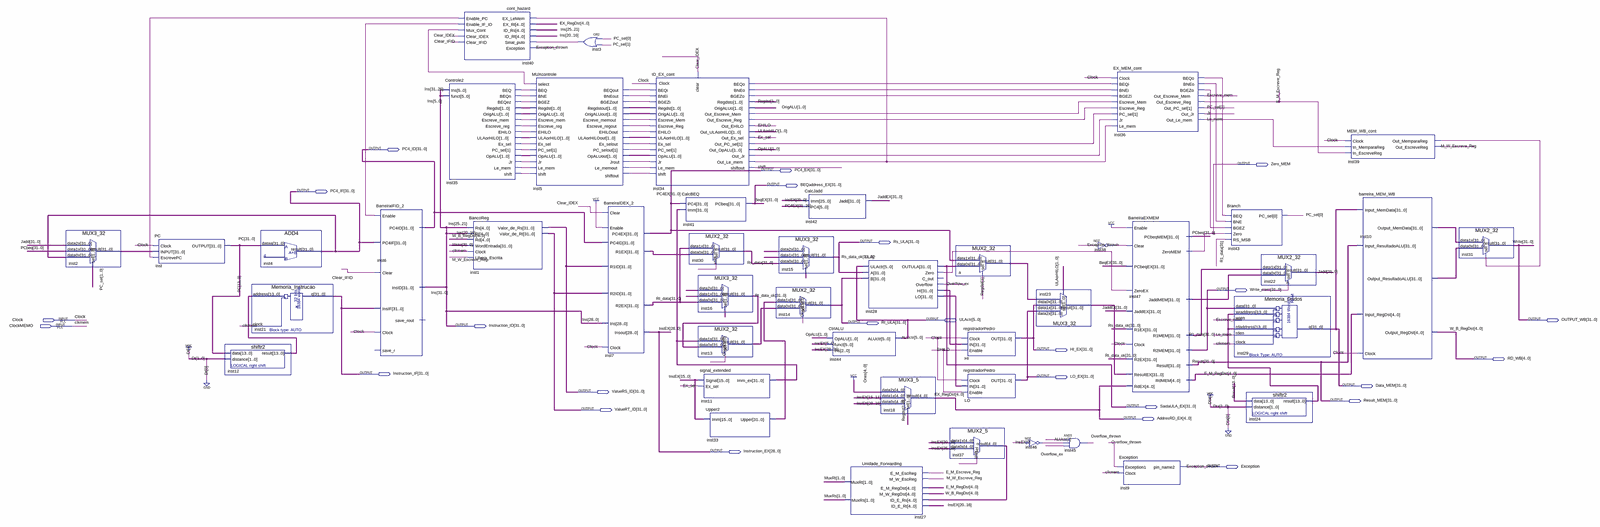
[diagram p0: schematic sheet, whole]
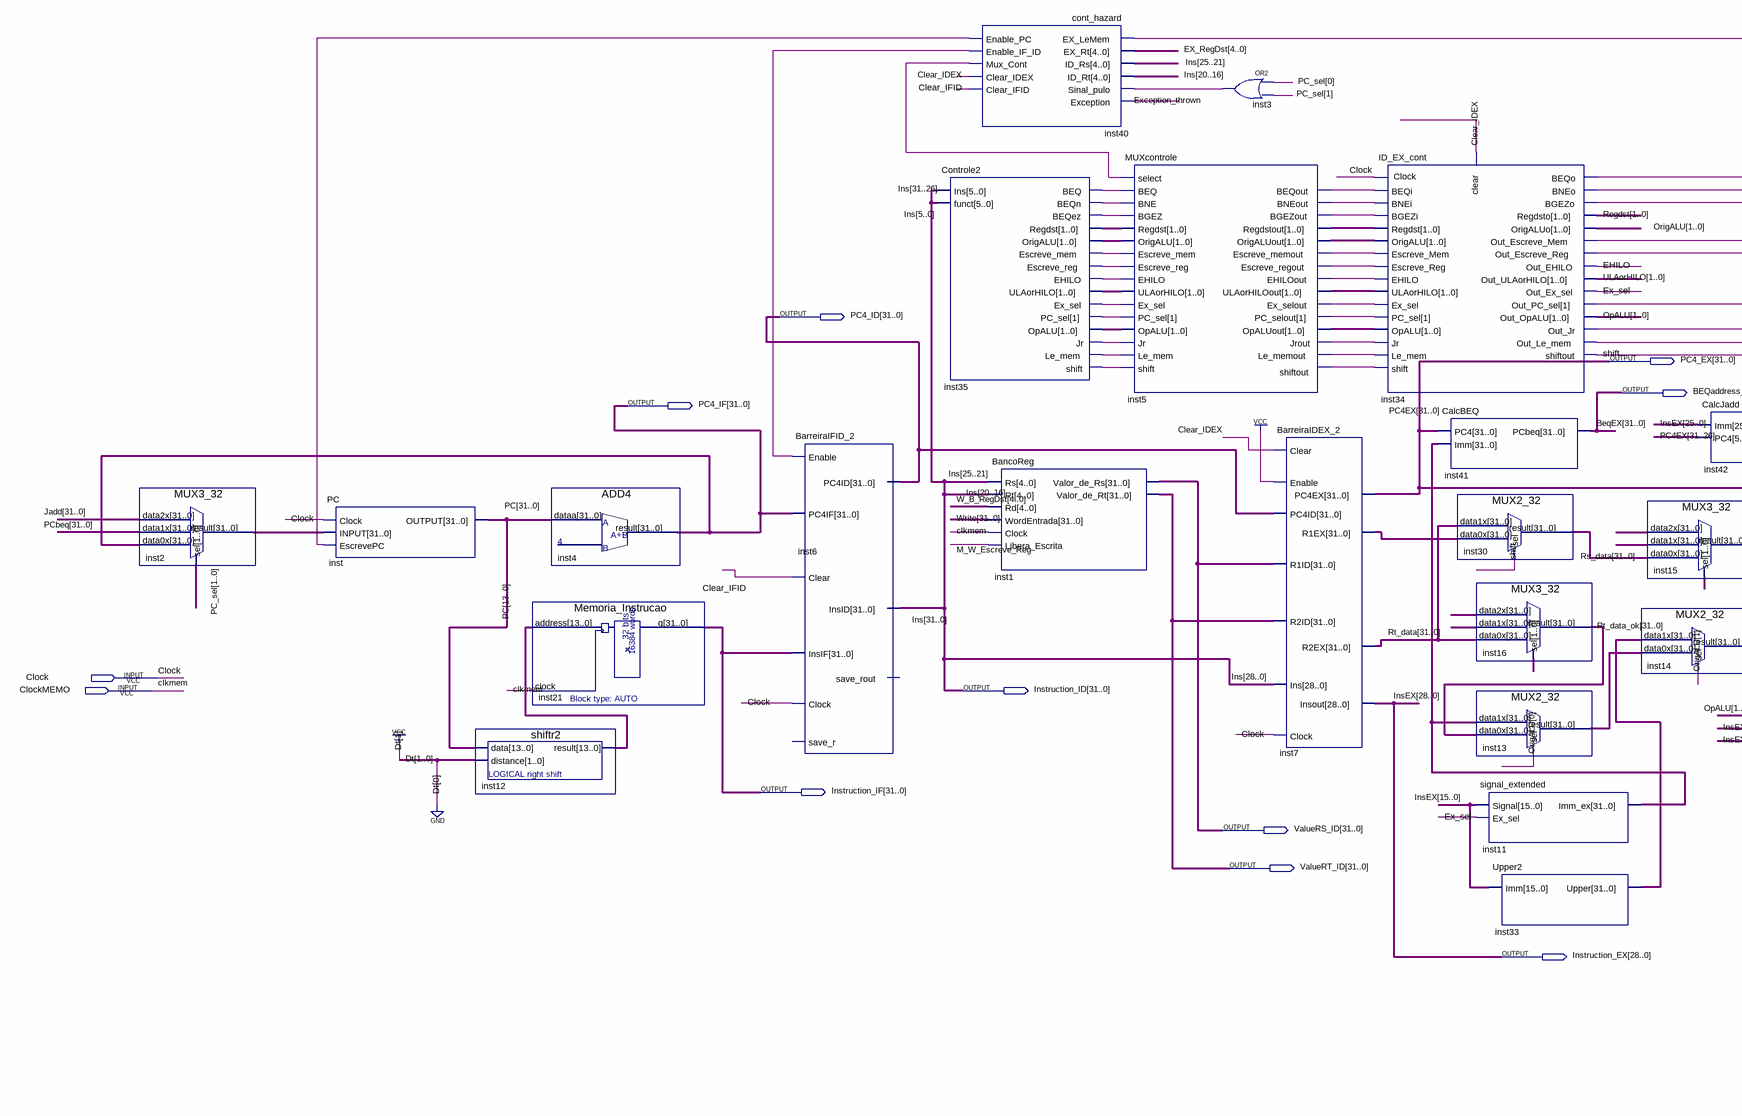
[diagram p1: schematic sheet, left part]
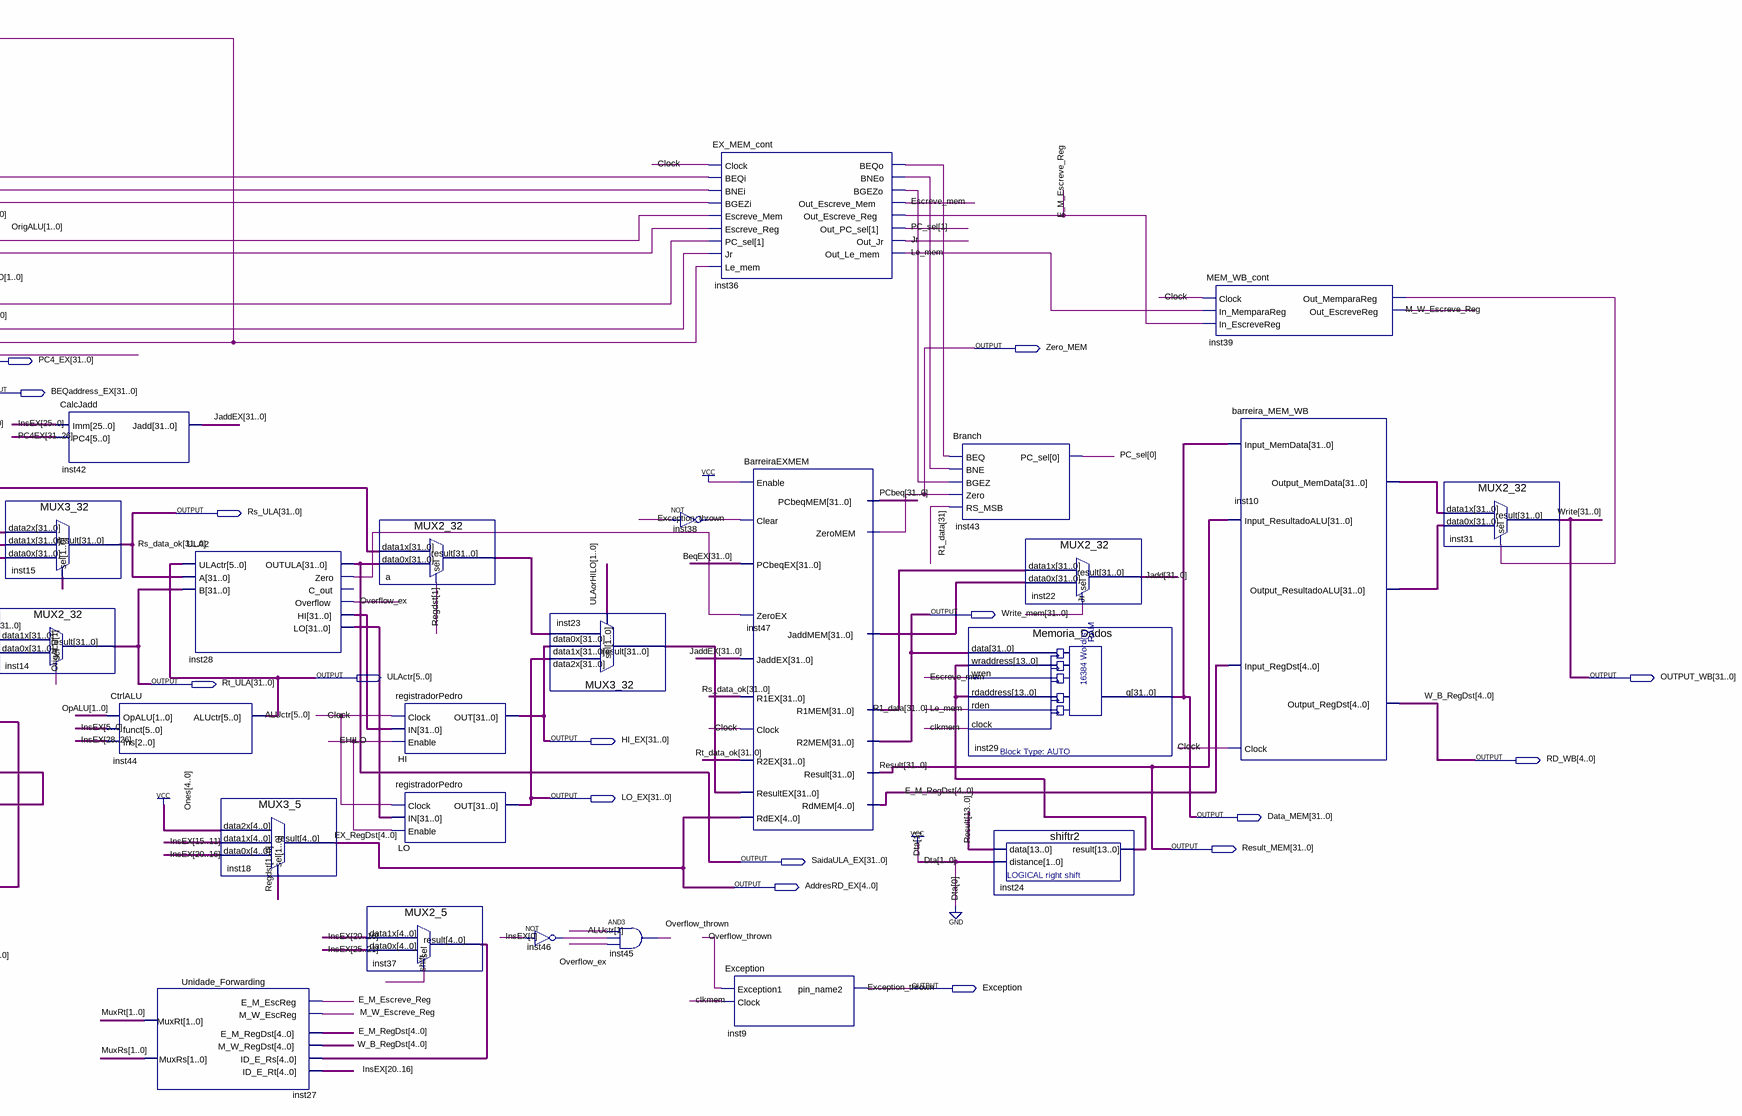
[diagram p2: schematic sheet, right part]
// Quartus schematic PIPELINE_FULL.bdf as structural Verilog: 44 symbols, 25 pins
module PIPELINE_FULL (
  input  Clock,
  input  ClockMEMO,
  output [31:0] PC4_ID,
  output Zero_MEM,
  output [31:0] PC4_EX,
  output [31:0] BEQaddress_EX,
  output [31:0] PC4_IF,
  output [31:0] Rs_ULA,
  output [31:0] Write_mem,
  output [5:0] ULActr,
  output [31:0] OUTPUT_WB,
  output [31:0] Rt_ULA,
  output [31:0] Instruction_ID,
  output [31:0] HI_EX,
  output [4:0] RD_WB,
  output [31:0] Instruction_IF,
  output [31:0] LO_EX,
  output [31:0] Data_MEM,
  output [31:0] ValueRS_ID,
  output [31:0] Result_MEM,
  output [31:0] SaidaULA_EX,
  output [31:0] ValueRT_ID,
  output [4:0] AddresRD_EX,
  output [28:0] Instruction_EX,
  output Exception
);

  wire Clear_IDEX, Clear_IFID, E_M_Escreve_Reg, EHILO, Escreve_mem, Ex_sel, inst3_out, inst5_beqout,
       inst5_bgezout, inst5_bneout, inst5_ehiloout, inst5_escreve_memout, inst5_escreve_regout,
       inst5_ex_selout, inst5_jrout, inst5_le_memout, inst5_pc_selout, inst5_shiftout, inst28_zero,
       inst34_beqo, inst34_bgezo, inst34_bneo, inst34_out_escreve_mem, inst34_out_escreve_reg, inst34_out_jr,
       inst34_out_le_mem, inst34_out_pc_sel, inst35_beq, inst35_beqez, inst35_beqn, inst35_ehilo,
       inst35_escreve_mem, inst35_escreve_reg, inst35_ex_sel, inst35_jr, inst35_le_mem, inst35_pc_sel,
       inst35_shift, inst36_beqo, inst36_bgezo, inst36_bneo, inst38_out, inst39_out_memparareg,
       inst40_enable_if_id, inst40_enable_pc, inst40_mux_cont, inst46_out, Jr, Le_mem, M_W_Escreve_Reg,
       Overflow_ex, Overflow_thrown, shift;
  wire [1:0] inst5_opaluout, inst5_origaluout, inst5_regdstout, inst5_ulaorhiloout, inst35_opalu,
       inst35_origalu, inst35_regdst, inst35_ulaorhilo, MuxRs, MuxRt, OpALU, OrigALU, PC_sel, Regdst,
       ULAorHILO;
  wire [4:0] E_M_RegDst, inst37_result;
  wire [13:0] inst12_result, inst24_result;
  wire [31:0] a_result, inst2_result, inst7_r1ex, inst10_output_memdata, inst10_output_resultadoalu,
       inst11_imm_ex, inst13_result, inst23_result, inst28_hi, inst28_lo, inst33_upper, inst47_jaddmem, Jadd,
       JaddEX, PC, PCbeq, R1_data, Rs_data, Rt_data, Rt_data_ok;

  MUX3_32 inst2 (.data2x(Jadd), .data1x(PCbeq), .data0x(PC4_IF), .sel(PC_sel), .result(inst2_result));
  PC inst (.EscrevePC(inst40_enable_pc), .Clock(Clock), .INPUT(inst2_result), .OUTPUT(PC));
  shiftr2 inst12 (.data(PC[13:0]), .distance(2'b10), .result(inst12_result));
  Memoria_Instrucao inst21 (.address(inst12_result), .clock(ClockMEMO), .q(Instruction_IF));
  ADD4 inst4 (.dataa(PC), .result(PC4_IF));
  BarreiraIFID_2 inst6 (
    .Enable(inst40_enable_if_id), .PC4IF(PC4_IF), .Clear(Clear_IFID), .InsIF(Instruction_IF), .Clock(Clock),
    .PC4ID(PC4_ID), .InsID(Instruction_ID));  // open: save_r, save_rout
  Controle2 inst35 (
    .Ins(Instruction_ID[31:26]), .funct(Instruction_ID[5:0]), .BEQ(inst35_beq), .BEQn(inst35_beqn),
    .BEQez(inst35_beqez), .Regdst(inst35_regdst), .OrigALU(inst35_origalu), .Escreve_mem(inst35_escreve_mem),
    .Escreve_reg(inst35_escreve_reg), .EHILO(inst35_ehilo), .ULAorHILO(inst35_ulaorhilo),
    .Ex_sel(inst35_ex_sel), .PC_sel(inst35_pc_sel), .OpALU(inst35_opalu), .Jr(inst35_jr),
    .Le_mem(inst35_le_mem), .shift(inst35_shift));
  cont_hazard inst40 (
    .EX_LeMem(inst34_out_le_mem), .EX_Rt(AddresRD_EX), .ID_Rs(Instruction_ID[25:21]),
    .ID_Rt(Instruction_ID[20:16]), .Sinal_pulo(inst3_out), .Exception(Exception),
    .Enable_PC(inst40_enable_pc), .Enable_IF_ID(inst40_enable_if_id), .Mux_Cont(inst40_mux_cont),
    .Clear_IDEX(Clear_IDEX), .Clear_IFID(Clear_IFID));
  BancoReg inst1 (
    .Rt(Instruction_ID[20:16]), .Rd(RD_WB), .Rs(Instruction_ID[25:21]), .WordEntrada(OUTPUT_WB),
    .Clock(ClockMEMO), .Libera_Escrita(M_W_Escreve_Reg), .Valor_de_Rs(ValueRS_ID), .Valor_de_Rt(ValueRT_ID));
  MUXcontrole inst5 (
    .select(inst40_mux_cont), .BEQ(inst35_beq), .BNE(inst35_beqn), .BGEZ(inst35_beqez),
    .Regdst(inst35_regdst), .OrigALU(inst35_origalu), .Escreve_mem(inst35_escreve_mem),
    .Escreve_reg(inst35_escreve_reg), .EHILO(inst35_ehilo), .ULAorHILO(inst35_ulaorhilo),
    .Ex_sel(inst35_ex_sel), .PC_sel(inst35_pc_sel), .OpALU(inst35_opalu), .Jr(inst35_jr),
    .Le_mem(inst35_le_mem), .shift(inst35_shift), .BEQout(inst5_beqout), .BNEout(inst5_bneout),
    .BGEZout(inst5_bgezout), .Regdstout(inst5_regdstout), .OrigALUout(inst5_origaluout),
    .Escreve_memout(inst5_escreve_memout), .Escreve_regout(inst5_escreve_regout), .EHILOout(inst5_ehiloout),
    .ULAorHILOout(inst5_ulaorhiloout), .Ex_selout(inst5_ex_selout), .PC_selout(inst5_pc_selout),
    .OpALUout(inst5_opaluout), .Jrout(inst5_jrout), .Le_memout(inst5_le_memout), .shiftout(inst5_shiftout));
  or inst3 (inst3_out, PC_sel[0], PC_sel[1]);
  BarreiraIDEX_2 inst7 (
    .Clear(Clear_IDEX), .Enable(1'b1), .PC4ID(PC4_ID), .R1ID(ValueRS_ID), .R2ID(ValueRT_ID),
    .Ins(Instruction_ID[28:0]), .Clock(Clock), .PC4EX(PC4_EX), .R1EX(inst7_r1ex), .R2EX(Rt_data),
    .Insout(Instruction_EX));
  ID_EX_cont inst34 (
    .clear(Clear_IDEX), .Clock(Clock), .BEQi(inst5_beqout), .BNEi(inst5_bneout), .BGEZi(inst5_bgezout),
    .Regdst(inst5_regdstout), .OrigALU(inst5_origaluout), .Escreve_Mem(inst5_escreve_memout),
    .Escreve_Reg(inst5_escreve_regout), .EHILO(inst5_ehiloout), .ULAorHILO(inst5_ulaorhiloout),
    .Ex_sel(inst5_ex_selout), .PC_sel(inst5_pc_selout), .OpALU(inst5_opaluout), .Jr(inst5_jrout),
    .Le_mem(inst5_le_memout), .shift(inst5_shiftout), .BEQo(inst34_beqo), .BNEo(inst34_bneo),
    .BGEZo(inst34_bgezo), .Regdsto(Regdst), .OrigALUo(OrigALU), .Out_Escreve_Mem(inst34_out_escreve_mem),
    .Out_Escreve_Reg(inst34_out_escreve_reg), .Out_EHILO(EHILO), .Out_ULAorHILO(ULAorHILO),
    .Out_Ex_sel(Ex_sel), .Out_PC_sel(inst34_out_pc_sel), .Out_OpALU(OpALU), .Out_Jr(inst34_out_jr),
    .Out_Le_mem(inst34_out_le_mem), .shiftout(shift));
  CalcBEQ inst41 (.PC4(PC4_EX), .Imm(inst11_imm_ex), .PCbeq(BEQaddress_EX));
  MUX2_32 inst30 (.data1x(Rt_data), .data0x(inst7_r1ex), .sel(shift), .result(Rs_data));
  MUX3_32 inst16 (.data2x(Result_MEM), .data1x(OUTPUT_WB), .data0x(Rt_data), .sel(MuxRt), .result(Rt_data_ok));
  MUX2_32 inst13 (.data1x(inst11_imm_ex), .data0x(Rt_data_ok), .sel(OrigALU[0]), .result(inst13_result));
  signal_extended inst11 (.Signal(Instruction_EX[15:0]), .Ex_sel(Ex_sel), .Imm_ex(inst11_imm_ex));
  Upper2 inst33 (.Imm(Instruction_EX[15:0]), .Upper(inst33_upper));
  MUX3_32 inst15 (.data2x(Result_MEM), .data1x(OUTPUT_WB), .data0x(Rs_data), .sel(MuxRs), .result(Rs_ULA));
  MUX2_32 inst14 (.data1x(inst33_upper), .data0x(inst13_result), .sel(OrigALU[1]), .result(Rt_ULA));
  CalcJadd inst42 (.Imm(Instruction_EX[25:0]), .PC4(PC4_EX[31:26]), .Jadd(JaddEX));
  CtrlALU inst44 (.OpALU(OpALU), .funct(Instruction_EX[5:0]), .Ins(Instruction_EX[28:26]), .ALUctr(ULActr));
  Unidade_Forwarding inst27 (
    .E_M_EscReg(E_M_Escreve_Reg), .M_W_EscReg(M_W_Escreve_Reg), .E_M_RegDst(E_M_RegDst), .M_W_RegDst(RD_WB),
    .ID_E_Rs(inst37_result), .ID_E_Rt(Instruction_EX[20:16]), .MuxRt(MuxRt), .MuxRs(MuxRs));
  ULA2 inst28 (
    .ULActr(ULActr), .A(Rs_ULA), .B(Rt_ULA), .OUTULA(SaidaULA_EX), .Zero(inst28_zero),
    .Overflow(Overflow_ex), .HI(inst28_hi), .LO(inst28_lo));  // open: C_out
  MUX3_5 inst18 (
    .data2x({5{1'b1}}), .data1x(Instruction_EX[15:11]), .data0x(Instruction_EX[20:16]), .sel(Regdst),
    .result(AddresRD_EX));
  MUX2_5 inst37 (.data1x(Instruction_EX[20:16]), .data0x(Instruction_EX[25:21]), .sel(shift), .result(inst37_result));
  MUX2_32 a (.data1x(PC4_EX), .data0x(SaidaULA_EX), .sel(Regdst[1]), .result(a_result));
  registradorPedro HI (.Clock(Clock), .IN(inst28_hi), .Enable(EHILO), .OUT(HI_EX));
  registradorPedro LO (.Clock(Clock), .IN(inst28_lo), .Enable(EHILO), .OUT(LO_EX));
  not inst46 (inst46_out, Instruction_EX[0]);
  MUX3_32 inst23 (.data2x(LO_EX), .data1x(HI_EX), .data0x(a_result), .sel(ULAorHILO), .result(inst23_result));
  and inst45 (Overflow_thrown, ULActr[1], inst46_out, Overflow_ex);
  not inst38 (inst38_out, Exception);
  EX_MEM_cont inst36 (
    .Clock(Clock), .BEQi(inst34_beqo), .BNEi(inst34_bneo), .BGEZi(inst34_bgezo),
    .Escreve_Mem(inst34_out_escreve_mem), .Escreve_Reg(inst34_out_escreve_reg), .PC_sel(inst34_out_pc_sel),
    .Jr(inst34_out_jr), .Le_mem(inst34_out_le_mem), .BEQo(inst36_beqo), .BNEo(inst36_bneo),
    .BGEZo(inst36_bgezo), .Out_Escreve_Mem(Escreve_mem), .Out_Escreve_Reg(E_M_Escreve_Reg),
    .Out_PC_sel(PC_sel[1]), .Out_Jr(Jr), .Out_Le_mem(Le_mem));
  Exception inst9 (.Exception1(Overflow_thrown), .Clock(ClockMEMO), .pin_name2(Exception));
  BarreiraEXMEM inst47 (
    .Enable(1'b1), .PCbeqEX(BEQaddress_EX), .ZeroEX(inst28_zero), .JaddEX(JaddEX), .Clear(inst38_out),
    .R1EX(Rs_ULA), .Clock(Clock), .R2EX(Rt_data_ok), .ResultEX(inst23_result), .RdEX(AddresRD_EX),
    .PCbeqMEM(PCbeq), .ZeroMEM(Zero_MEM), .JaddMEM(inst47_jaddmem), .R1MEM(R1_data), .R2MEM(Write_mem),
    .Result(Result_MEM), .RdMEM(E_M_RegDst));
  Branch inst43 (
    .BEQ(inst36_beqo), .BNE(inst36_bneo), .BGEZ(inst36_bgezo), .Zero(Zero_MEM), .RS_MSB(R1_data[31]),
    .PC_sel(PC_sel[0]));
  Memoria_Dados inst29 (
    .data(Write_mem), .wraddress(inst24_result), .wren(Escreve_mem), .rdaddress(inst24_result),
    .rden(Le_mem), .clock(ClockMEMO), .q(Data_MEM));
  MUX2_32 inst22 (.data1x(R1_data), .data0x(inst47_jaddmem), .sel(Jr), .result(Jadd));
  shiftr2 inst24 (.data(Result_MEM[13:0]), .distance(2'b10), .result(inst24_result));
  MEM_WB_cont inst39 (
    .Clock(Clock), .In_MemparaReg(Le_mem), .In_EscreveReg(E_M_Escreve_Reg),
    .Out_MemparaReg(inst39_out_memparareg), .Out_EscreveReg(M_W_Escreve_Reg));
  barreira_MEM_WB inst10 (
    .Clock(Clock), .Input_MemData(Data_MEM), .Input_ResultadoALU(Result_MEM), .Input_RegDst(E_M_RegDst),
    .Output_MemData(inst10_output_memdata), .Output_ResultadoALU(inst10_output_resultadoalu),
    .Output_RegDst(RD_WB));
  MUX2_32 inst31 (
    .data1x(inst10_output_memdata), .data0x(inst10_output_resultadoalu), .sel(inst39_out_memparareg),
    .result(OUTPUT_WB));

  // Other names for the same wires on the sheet: ALUctr[5:0] = ULActr; BeqEX[31:0] = BEQaddress_EX;
  //   clkmem = ClockMEMO; EX_RegDst[4:0] = AddresRD_EX; Exception_thrown = Exception; InsEX[28:0] = Instruction_EX;
  //   Ins[31:0] = Instruction_ID; Write[31:0] = OUTPUT_WB; PC4EX[31:0] = PC4_EX; W_B_RegDst[4:0] = RD_WB;
  //   Result[31:0] = Result_MEM; Rs_data_ok[31:0] = Rs_ULA
endmodule
